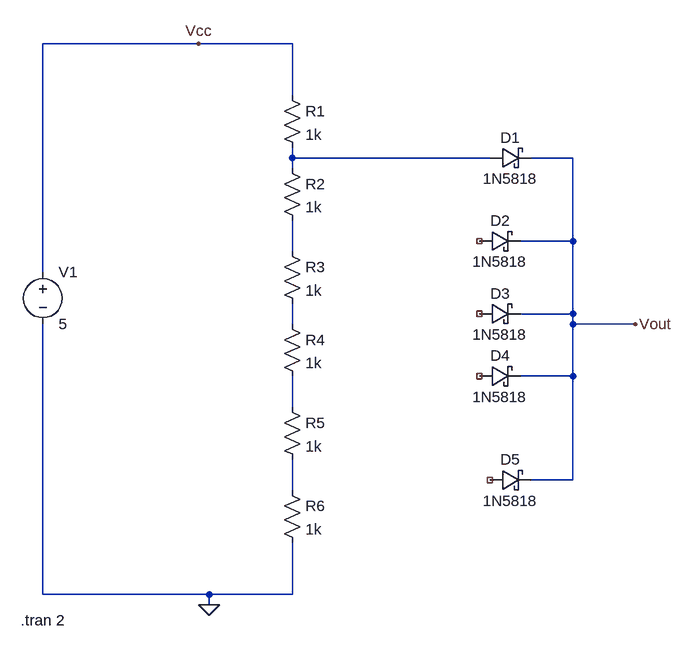
[diagram p0: schematic series.asc]
series.asc, the LTspice schematic file:
Version 4
SHEET 1 960 680
WIRE 208 -240 -32 -240
WIRE 352 -240 208 -240
WIRE 352 -160 352 -240
WIRE 352 -64 352 -80
WIRE 656 -64 352 -64
WIRE 784 -64 720 -64
WIRE 352 -48 352 -64
WIRE 784 64 784 -64
WIRE 784 64 704 64
WIRE 352 80 352 32
WIRE -32 112 -32 -240
WIRE 784 176 784 64
WIRE 784 176 704 176
WIRE 352 192 352 160
WIRE 784 192 784 176
WIRE 880 192 784 192
WIRE 784 272 784 192
WIRE 784 272 704 272
WIRE 352 320 352 272
WIRE 784 432 784 272
WIRE 784 432 720 432
WIRE 352 448 352 400
WIRE -32 608 -32 192
WIRE 224 608 -32 608
WIRE 352 608 352 528
WIRE 352 608 224 608
WIRE 224 624 224 608
FLAG 224 624 0
FLAG 208 -240 Vcc
FLAG 880 192 Vout
SYMBOL voltage -32 96 R0
WINDOW 123 0 0 Left 2
WINDOW 39 0 0 Left 2
SYMATTR InstName V1
SYMATTR Value 5
SYMBOL res 336 -176 R0
SYMATTR InstName R1
SYMATTR Value 1k
SYMBOL res 336 -64 R0
SYMATTR InstName R2
SYMATTR Value 1k
SYMBOL res 336 64 R0
SYMATTR InstName R3
SYMATTR Value 1k
SYMBOL res 336 176 R0
SYMATTR InstName R4
SYMATTR Value 1k
SYMBOL res 336 304 R0
SYMATTR InstName R5
SYMATTR Value 1k
SYMBOL res 336 432 R0
SYMATTR InstName R6
SYMATTR Value 1k
SYMBOL schottky 656 -48 R270
WINDOW 0 32 32 VTop 2
WINDOW 3 0 32 VBottom 2
SYMATTR InstName D1
SYMATTR Value 1N5818
SYMATTR Description Diode
SYMATTR Type diode
SYMBOL schottky 640 80 R270
WINDOW 0 32 32 VTop 2
WINDOW 3 0 32 VBottom 2
SYMATTR InstName D2
SYMATTR Value 1N5818
SYMATTR Description Diode
SYMATTR Type diode
SYMBOL schottky 640 192 R270
WINDOW 0 32 32 VTop 2
WINDOW 3 0 32 VBottom 2
SYMATTR InstName D3
SYMATTR Value 1N5818
SYMATTR Description Diode
SYMATTR Type diode
SYMBOL schottky 640 288 R270
WINDOW 0 32 32 VTop 2
WINDOW 3 0 32 VBottom 2
SYMATTR InstName D4
SYMATTR Value 1N5818
SYMATTR Description Diode
SYMATTR Type diode
SYMBOL schottky 656 448 R270
WINDOW 0 32 32 VTop 2
WINDOW 3 0 32 VBottom 2
SYMATTR InstName D5
SYMATTR Value 1N5818
SYMATTR Description Diode
SYMATTR Type diode
TEXT -66 648 Left 2 !.tran 2

The netlist it stands for:
* series.asc
V1 Vcc 0 5
R1 Vcc N001 1k
R2 N001 N002 1k
R3 N002 N003 1k
R4 N003 N004 1k
R5 N004 N005 1k
R6 N005 0 1k
D1 N001 Vout 1N5818
D2 NC_01 Vout 1N5818
D3 NC_02 Vout 1N5818
D4 NC_03 Vout 1N5818
D5 NC_04 Vout 1N5818
.model D D
.lib standard.dio
.tran 2
.backanno
.end